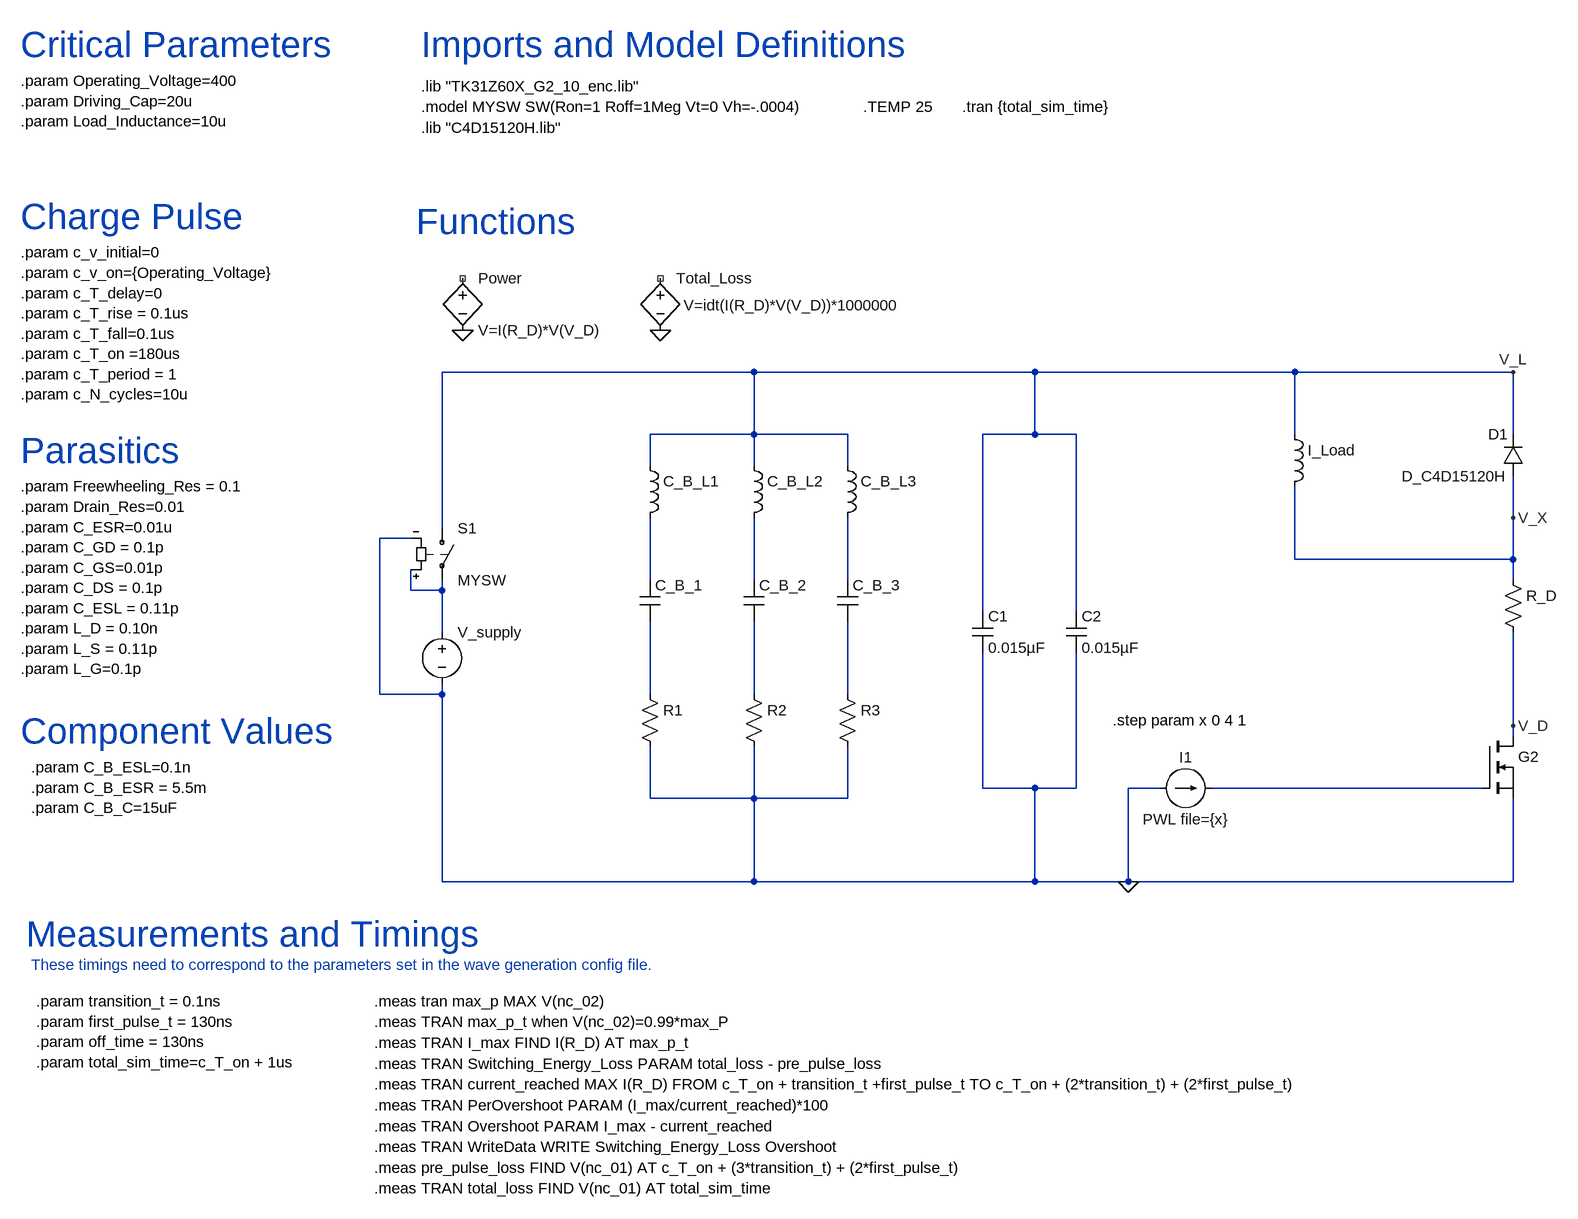
[diagram p0: schematic DPT_AGD_IDEALISED_COMP.asc]
DPT_AGD_IDEALISED_COMP.asc, the LTspice schematic file:
Version 4
SHEET 1 2220 2284
WIRE -208 736 -688 736
WIRE 224 736 -208 736
WIRE 624 736 224 736
WIRE 960 736 624 736
WIRE -208 832 -208 736
WIRE -208 832 -368 832
WIRE -64 832 -208 832
WIRE 224 832 224 736
WIRE 224 832 144 832
WIRE 288 832 224 832
WIRE 624 832 624 736
WIRE 960 832 960 736
WIRE -368 880 -368 832
WIRE -208 880 -208 832
WIRE -64 880 -64 832
WIRE 960 960 960 896
WIRE -688 976 -688 736
WIRE -736 992 -784 992
WIRE 624 1024 624 912
WIRE 960 1024 960 960
WIRE 960 1024 624 1024
WIRE -368 1056 -368 960
WIRE -208 1056 -208 960
WIRE -64 1056 -64 960
WIRE 960 1056 960 1024
WIRE -736 1072 -736 1040
WIRE -688 1072 -688 1056
WIRE -688 1072 -736 1072
WIRE 144 1104 144 832
WIRE 288 1104 288 832
WIRE -688 1136 -688 1072
WIRE -784 1232 -784 992
WIRE -688 1232 -688 1216
WIRE -688 1232 -784 1232
WIRE -368 1232 -368 1120
WIRE -208 1232 -208 1120
WIRE -64 1232 -64 1120
WIRE 960 1280 960 1136
WIRE 960 1296 960 1280
WIRE 144 1376 144 1168
WIRE 224 1376 144 1376
WIRE 288 1376 288 1168
WIRE 288 1376 224 1376
WIRE 416 1376 368 1376
WIRE 912 1376 496 1376
WIRE -368 1392 -368 1312
WIRE -208 1392 -208 1312
WIRE -208 1392 -368 1392
WIRE -64 1392 -64 1312
WIRE -64 1392 -208 1392
WIRE -688 1520 -688 1232
WIRE -208 1520 -208 1392
WIRE -208 1520 -688 1520
WIRE 224 1520 224 1376
WIRE 224 1520 -208 1520
WIRE 368 1520 368 1376
WIRE 368 1520 224 1520
WIRE 960 1520 960 1392
WIRE 960 1520 368 1520
FLAG 960 1280 V_D
FLAG 960 736 V_L
FLAG 368 1520 0
FLAG 960 960 V_X
FLAG -656 672 0
FLAG -352 672 0
SYMBOL ind 608 816 R0
WINDOW 3 36 80 Invisible 2
SYMATTR Value {Load_Inductance}
SYMATTR InstName I_Load
SYMBOL nmos 912 1296 R0
WINDOW 3 59 60 Invisible 2
SYMATTR Value TK31Z60X_G2_10
SYMATTR InstName G2
SYMATTR Prefix X
SYMBOL res 944 1040 R0
WINDOW 3 36 76 Invisible 2
SYMATTR Value {Drain_Res}
SYMATTR InstName R_D
SYMBOL sw -688 960 R0
SYMATTR InstName S1
SYMATTR Value MYSW
SYMBOL voltage -688 1120 R0
WINDOW 3 24 96 Invisible 2
WINDOW 123 0 0 Left 0
WINDOW 39 0 0 Left 0
SYMATTR Value PULSE({c_v_initial} {c_v_on} {c_T_delay} {c_T_rise} {c_T_fall} {c_T_on} {c_T_period} {c_N_cycles})
SYMATTR InstName V_supply
SYMBOL bv -352 576 R0
WINDOW 3 36 57 Left 2
SYMATTR Value V=idt(I(R_D)*V(V_D))*1000000
SYMATTR InstName Total_Loss
SYMBOL bv -656 576 R0
SYMATTR InstName Power
SYMATTR Value V=I(R_D)*V(V_D)
SYMBOL cap -384 1056 R0
WINDOW 3 24 56 Invisible 2
SYMATTR Value {C_B_C}
SYMATTR InstName C_B_1
SYMBOL ind -384 864 R0
WINDOW 3 36 80 Invisible 2
SYMATTR Value {C_B_ESL}
SYMATTR InstName C_B_L1
SYMBOL res -384 1216 R0
WINDOW 3 36 76 Invisible 2
SYMATTR Value {C_B_ESR}
SYMATTR InstName R1
SYMBOL cap -224 1056 R0
WINDOW 3 24 56 Invisible 2
SYMATTR Value {C_B_C}
SYMATTR InstName C_B_2
SYMBOL ind -224 864 R0
WINDOW 3 36 80 Invisible 2
SYMATTR Value {C_B_ESL}
SYMATTR InstName C_B_L2
SYMBOL res -224 1216 R0
WINDOW 3 36 76 Invisible 2
SYMATTR Value {C_B_ESR}
SYMATTR InstName R2
SYMBOL cap -80 1056 R0
WINDOW 3 24 56 Invisible 2
SYMATTR Value {C_B_C}
SYMATTR InstName C_B_3
SYMBOL ind -80 864 R0
WINDOW 3 36 80 Invisible 2
SYMATTR Value {C_B_ESL}
SYMATTR InstName C_B_L3
SYMBOL res -80 1216 R0
WINDOW 3 36 76 Invisible 2
SYMATTR Value {C_B_ESR}
SYMATTR InstName R3
SYMBOL current 416 1376 R270
WINDOW 0 32 40 VTop 2
WINDOW 3 -32 40 VBottom 2
WINDOW 123 0 0 Left 0
WINDOW 39 0 0 Left 0
SYMATTR InstName I1
SYMATTR Value PWL file={x}
SYMBOL diode 976 896 R180
WINDOW 0 24 64 Left 2
WINDOW 3 24 0 Left 2
SYMATTR InstName D1
SYMATTR Value D_C4D15120H
SYMBOL cap 128 1104 R0
SYMATTR InstName C1
SYMATTR Value 0.015µF
SYMBOL cap 272 1104 R0
SYMATTR InstName C2
SYMATTR Value 0.015µF
TEXT -720 296 Left 2 !.lib "TK31Z60X_G2_10_enc.lib"
TEXT -720 328 Left 2 !.model MYSW SW(Ron=1 Roff=1Meg Vt=0 Vh=-.0004)
TEXT 112 328 Left 2 !.tran {total_sim_time}
TEXT -1336 496 Left 5 ;Charge Pulse
TEXT -720 232 Left 5 ;Imports and Model Definitions
TEXT -1336 288 Left 2 !.param Operating_Voltage=400\n.param Driving_Cap=20u\n.param Load_Inductance=10u
TEXT -1336 552 Left 2 !.param c_v_initial=0\n.param c_v_on={Operating_Voltage}\n.param c_T_delay=0\n.param c_T_rise = 0.1us\n.param c_T_fall=0.1us\n.param c_T_on =180us\n.param c_T_period = 1\n.param c_N_cycles=10u
TEXT -40 328 Left 2 !.TEMP 25
TEXT -728 504 Left 5 ;Functions
TEXT -1336 856 Left 5 ;Parasitics
TEXT -1336 912 Left 2 !.param Freewheeling_Res = 0.1\n.param Drain_Res=0.01\n.param C_ESR=0.01u\n.param C_GD = 0.1p\n.param C_GS=0.01p\n.param C_DS = 0.1p\n.param C_ESL = 0.11p\n.param L_D = 0.10n\n.param L_S = 0.11p\n.param L_G=0.1p
TEXT -1336 232 Left 5 ;Critical Parameters
TEXT -720 360 Left 2 !.lib "C4D15120H.lib"
TEXT -1336 1288 Left 5 ;Component Values
TEXT -1320 1344 Left 2 !.param C_B_ESL=0.1n\n.param C_B_ESR = 5.5m\n.param C_B_C=15uF
TEXT -792 1768 Left 2 !.meas TRAN I_max FIND I(R_D) AT max_p_t
TEXT -1328 1600 Left 5 ;Measurements and Timings
TEXT -792 1800 Left 2 !.meas TRAN Switching_Energy_Loss PARAM total_loss - pre_pulse_loss
TEXT -792 1832 Left 2 !.meas TRAN current_reached MAX I(R_D) FROM c_T_on + transition_t +first_pulse_t TO c_T_on + (2*transition_t) + (2*first_pulse_t)
TEXT -792 1864 Left 2 !.meas TRAN PerOvershoot PARAM (I_max/current_reached)*100
TEXT -792 1896 Left 2 !.meas TRAN Overshoot PARAM I_max - current_reached
TEXT 344 1272 Left 2 !.step param x 0 4 1
TEXT -792 1928 Left 2 !.meas TRAN WriteData WRITE Switching_Energy_Loss Overshoot
TEXT -1320 1648 Left 2 ;These timings need to correspond to the parameters set in the wave generation config file.
TEXT -1312 1704 Left 2 !.param transition_t = 0.1ns\n.param first_pulse_t = 130ns\n.param off_time = 130ns\n.param total_sim_time=c_T_on + 1us
TEXT -792 1704 Left 2 !.meas tran max_p MAX V(nc_02)\n.meas TRAN max_p_t when V(nc_02)=0.99*max_P
TEXT -792 1960 Left 2 !.meas pre_pulse_loss FIND V(nc_01) AT c_T_on + (3*transition_t) + (2*first_pulse_t)
TEXT -792 1992 Left 2 !.meas TRAN total_loss FIND V(nc_01) AT total_sim_time

The netlist it stands for:
* DPT_AGD_IDEALISED_COMP.asc
L§I_Load V_L V_X {Load_Inductance}
XG2 V_D N008 0 TK31Z60X_G2_10  ; pins D G S
R_D V_X V_D {Drain_Res}
S1 V_L N004 N004 0 MYSW
V_supply N004 0 PULSE({c_v_initial} {c_v_on} {c_T_delay} {c_T_rise} {c_T_fall} {c_T_on} {c_T_period} {c_N_cycles})
B§Total_Loss NC_01 0 V=idt(I(R_D)*V(V_D))*1000000
B§Power NC_02 0 V=I(R_D)*V(V_D)
C_B_1 N001 N005 {C_B_C}
L§C_B_L1 V_L N001 {C_B_ESL}
R1 N005 0 {C_B_ESR}
C_B_2 N002 N006 {C_B_C}
L§C_B_L2 V_L N002 {C_B_ESL}
R2 N006 0 {C_B_ESR}
C_B_3 N003 N007 {C_B_C}
L§C_B_L3 V_L N003 {C_B_ESL}
R3 N007 0 {C_B_ESR}
I1 0 N008 PWL file={x}
D1 V_X V_L D_C4D15120H
C1 V_L 0 0.015µF
C2 V_L 0 0.015µF
.model D D
.lib standard.dio
.lib "TK31Z60X_G2_10_enc.lib"
.model MYSW SW(Ron=1 Roff=1Meg Vt=0 Vh=-.0004)
.tran {total_sim_time}
* Charge Pulse
* Imports and Model Definitions
.param Operating_Voltage=400
.param Driving_Cap=20u
.param Load_Inductance=10u
.param c_v_initial=0
.param c_v_on={Operating_Voltage}
.param c_T_delay=0
.param c_T_rise = 0.1us
.param c_T_fall=0.1us
.param c_T_on =180us
.param c_T_period = 1
.param c_N_cycles=10u
.TEMP 25
* Functions
* Parasitics
.param Freewheeling_Res = 0.1
.param Drain_Res=0.01
.param C_ESR=0.01u
.param C_GD = 0.1p
.param C_GS=0.01p
.param C_DS = 0.1p
.param C_ESL = 0.11p
.param L_D = 0.10n
.param L_S = 0.11p
.param L_G=0.1p
* Critical Parameters
.lib "C4D15120H.lib"
* Component Values
.param C_B_ESL=0.1n
.param C_B_ESR = 5.5m
.param C_B_C=15uF
.meas TRAN I_max FIND I(R_D) AT max_p_t
* Measurements and Timings
.meas TRAN Switching_Energy_Loss PARAM total_loss - pre_pulse_loss
.meas TRAN current_reached MAX I(R_D) FROM c_T_on + transition_t +first_pulse_t TO c_T_on + (2*transition_t) + (2*first_pulse_t)
.meas TRAN PerOvershoot PARAM (I_max/current_reached)*100
.meas TRAN Overshoot PARAM I_max - current_reached
.step param x 0 4 1
.meas TRAN WriteData WRITE Switching_Energy_Loss Overshoot
* These timings need to correspond to the parameters set in the wave generation config file.
.param transition_t = 0.1ns
.param first_pulse_t = 130ns
.param off_time = 130ns
.param total_sim_time=c_T_on + 1us
.meas tran max_p MAX V(nc_02)
.meas TRAN max_p_t when V(nc_02)=0.99*max_P
.meas pre_pulse_loss FIND V(nc_01) AT c_T_on + (3*transition_t) + (2*first_pulse_t)
.meas TRAN total_loss FIND V(nc_01) AT total_sim_time
.backanno
.end